# Altium schematic sheet Grove - Vibration Sensor (SW-420) v1.1.SchDoc: Grove - Vibration Sensor (SW-420) v1.1
size 282 x 376 mm; Date: 7/25/2018 7:15:21 AM; SheetNumber: 1; Origin: Eagle; GateName_1: G$1; SymbolName_1: SEEEDSTUDIO-OPEN-SCH-FRAME; LibraryName: moudle-new; DeviceSetName: SEEEDSTUDIO-OPEN-SCH-FRAME; Sheet: Sheet:; SeeedStudio: Seeed Studio; Design: Design:; Check: Check:; Vision: Vision:; CC-BY-SA: CC-BY-SA
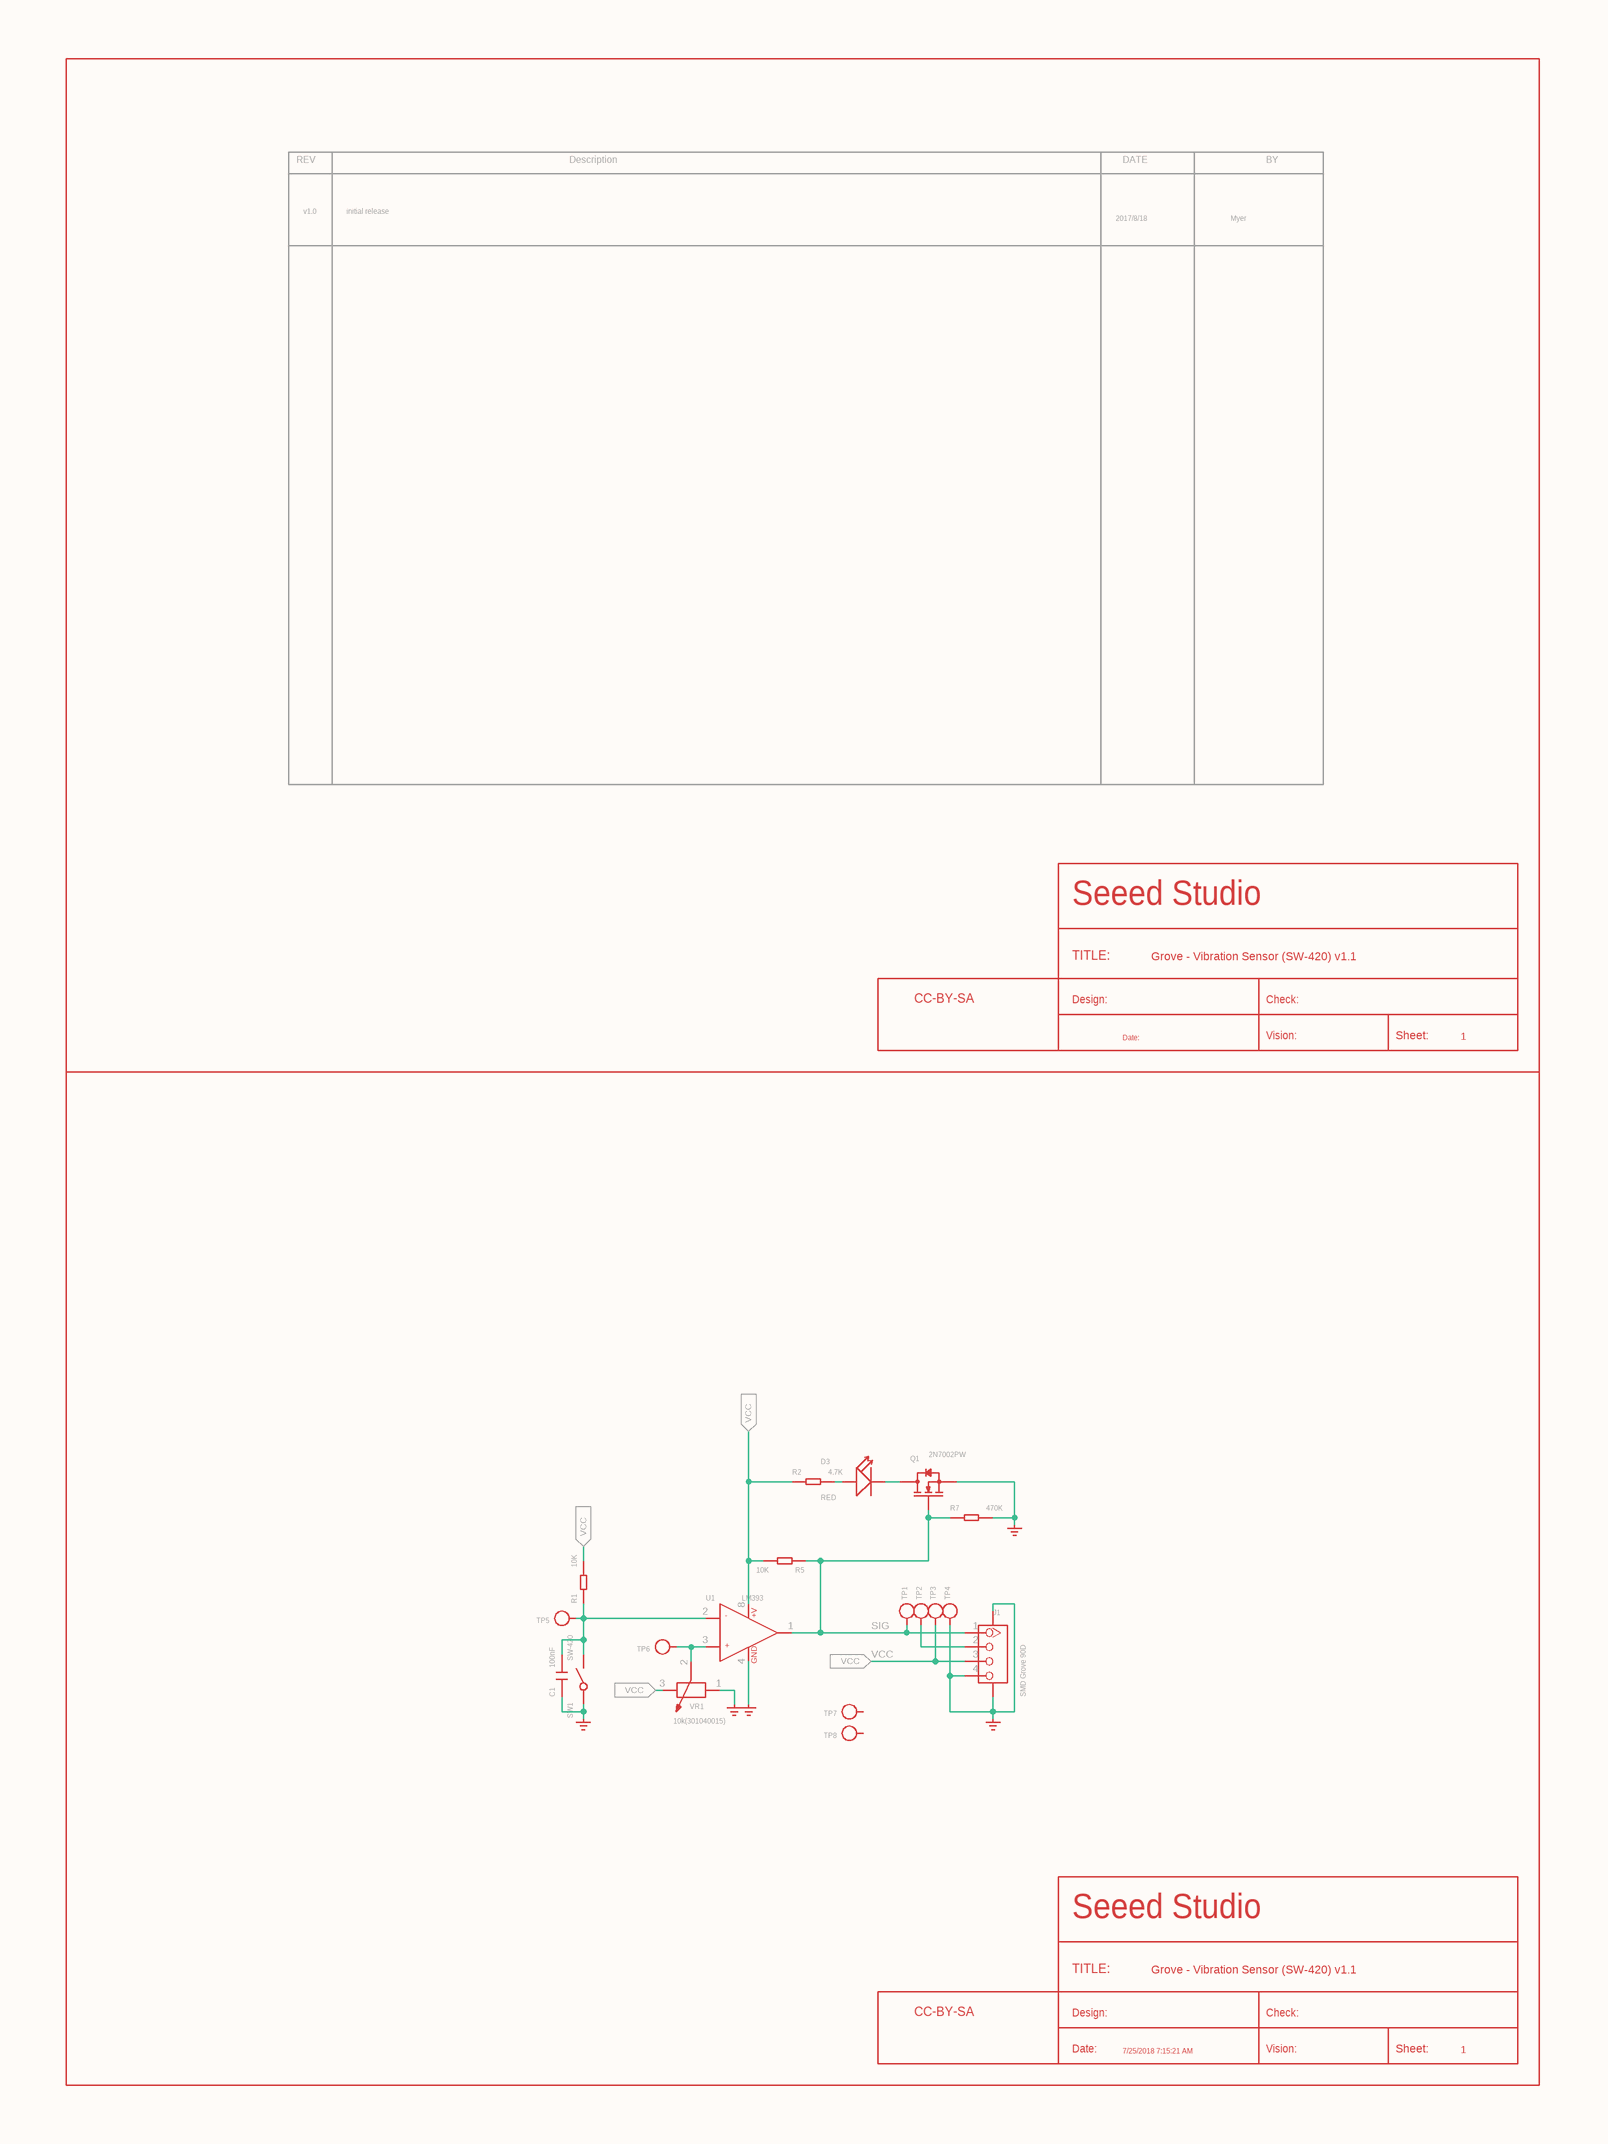
[diagram p0: Grove - Vibration Sensor (SW-420) v1.1.SchDoc]

## Parts
C1  100nF  [C0603]
D3  RED  [LED-0603]
FR2  DRAWING_NAME: Grove - Vibration Sensor (SW-420) v1.1  SHEET: 1  Sheet: Sheet:  SeeedStudio: Seeed Studio  TITLE: TITLE:  Design: Design:  Check: Check:  Vision: Vision:  Date: Date:  [SEEEDSTUDIO-PCB-FRAME]  (hidden comment: SEEEDSTUDIO-OPEN-SCH-FRAME)
J1  SMD Grove 90D  [HW4-SMD-2.0-90D]
Q1  2N7002PW  [SOT-23]
R1  10K  [R0603]
R2  4.7K  [R0603]
R5  10K  [R0603]
R7  470K  [R0603]
SW1  SW-420  [SW2-10.0-5X10MM]
TP1  TEST-POINT'4545'  [TP-D45MIL]  (value not drawn)
TP2  TEST-POINT'4545'  [TP-D45MIL]  (value not drawn)
TP3  TEST-POINT'4545'  [TP-D45MIL]  (value not drawn)
TP4  TEST-POINT'4545'  [TP-D45MIL]  (value not drawn)
TP5  TEST-POINT'4545'  [TP-D45MIL]  (value not drawn)
TP6  TEST-POINT'4545'  [TP-D45MIL]  (value not drawn)
TP7  TEST-POINT'4545'  [TP-D45MIL]  (value not drawn)
TP8  TEST-POINT'4545'  [TP-D45MIL]  (value not drawn)
U1  LM393  [SOIC8-1.27-5X4MM]
U$1  GND_POWER  (value not drawn)
U$2  GND_POWER  (value not drawn)
U$10  SEEDSTUDIO-SCH-MODLIST  (value not drawn)
U$11  GND_POWER  (value not drawn)
U$12  GND_POWER  (value not drawn)
U$13  GND_POWER  (value not drawn)
VR1  10k(301040015)  [ADJR3-SMD-4.6X3.7MM]

## Ports
VCC (in)

## Nets
SIG: J1.1 Q1.1(G) R5.1 R7.1 TP1.T U1.1(OUT1)
VCC: J1.3 R1.2 R2.1 R5.2 TP3.T U1.8(+V) VR1.3 ; port VCC
NetC1_1: C1.1 SW1.1 U$2.?1(GND)
NetC1_2: C1.2 R1.1 SW1.2 TP5.T U1.2(-IN1)
NetD3_+: D3.+ R2.2
NetD3_-: D3.- Q1.3(D)
NetJ1_2: J1.2 TP2.T
NetJ1_4: J1.4 J1.SS1 J1.SS2 TP4.T U$1.?1(GND)
NetQ1_2: Q1.2(S) R7.2 U$13.?1(GND)
NetTP6_T: TP6.T U1.3(+IN1) VR1.2
NetU1_4: U1.4(GND) U$12.?1(GND)
NetU$11_?1: U$11.?1(GND) VR1.1

Not connected (* = marked no-connect by the designer): TP7 T; TP8 T

## Notes on the sheet
- v1.0
- initial release
- 2017/8/18
- Myer
- Seeed Studio
- CC-BY-SA
- TITLE:
- Design:
- Grove - Vibration Sensor (SW-420) v1.1
- Check:
- Date:
- 7/25/2018 7:15:21 AM
- Vision:
- Sheet:
- 1

## Library data of the parts
C1 = C*-0603: Ceramic Capacitors; GateName_1: C; DeviceName: -0603; DeviceSetName: C*; SymbolName_1: C; LibraryName: Discrete-small
D3 = LED'0603': GateName_1: LED; DeviceName: '0603'; SymbolName_1: LED; LibraryName: Discrete-new; DeviceSetName: LED
FR2 = SEEEDSTUDIO-OPEN-SCH-FRAME: GateName_1: G$1; SymbolName_1: SEEEDSTUDIO-OPEN-SCH-FRAME; LibraryName: moudle-new; DeviceSetName: SEEEDSTUDIO-OPEN-SCH-FRAME; CC-BY-SA: CC-BY-SA
J1 = GROVE-CONNECTOR-SMD'90D': 4P-SMD-2.0:320110030;4P-SMD-2.0-90D:320110032; GateName_1: G$1; DeviceName: '90D'; SymbolName_1: GROVE-CONNECTOR-SMD; LibraryName: Connector-new; DeviceSetName: GROVE-CONNECTOR-SMD
Q1 = MOSFET-N'SOT23': GateName_1: MOS; SymbolName_1: N-MOS; DeviceName: 'SOT23'; LibraryName: Discrete-new; DeviceSetName: MOSFET-N; D: D; S: S; G: G
R1 R2 R5 R7 = R*-0603: GateName_1: R; DeviceName: -0603; DeviceSetName: R*; SymbolName_1: R; LibraryName: Discrete-small
SW1 = SWITCH-2P-SW-420: GateName_1: G$1; SymbolName_1: SWITCH-2P; DeviceName: -SW-420; LibraryName: Discrete-new; DeviceSetName: SWITCH-2P
TP1-TP8 = TEST-POINT'4545': PARTNO: DNP; GateName_1: TP; DeviceName: '4545'; SymbolName_1: TEST-POINT; LibraryName: Discrete-new; DeviceSetName: TEST-POINT
U1 = AMPLIFIER-LMV358'D': SOIC-8:310020002;MSOP-8:310020007; GateName_1: A; SymbolName_1: OPAMP_2; DeviceName: 'D'; LibraryName: IC-new; DeviceSetName: AMPLIFIER-LMV358; -: -; +: +; +V: +V; GND: GND
U$1 U$2 U$11-U$13 = GND_POWER: GateName_1: G$1; SymbolName_1: GND_POWER; LibraryName: Power or GND; DeviceSetName: GND_POWER
U$10 = SEEDSTUDIO-SCH-MODLIST: GateName_1: G$1; SymbolName_1: SEEDSTUDIO-SCH-MODLIST; LibraryName: moudle-new; DeviceSetName: SEEDSTUDIO-SCH-MODLIST; REV: REV; Description: Description; DATE: DATE; BY: BY
VR1 = RES-ADJ'RTRIM3214W': Potentiometer; GateName_1: RP; SymbolName_1: RES-ADJ; DeviceName: 'RTRIM3214W'; LibraryName: Discrete-new; DeviceSetName: RES-ADJ